# Altium schematic sheet AD5410.SchDoc
size A4
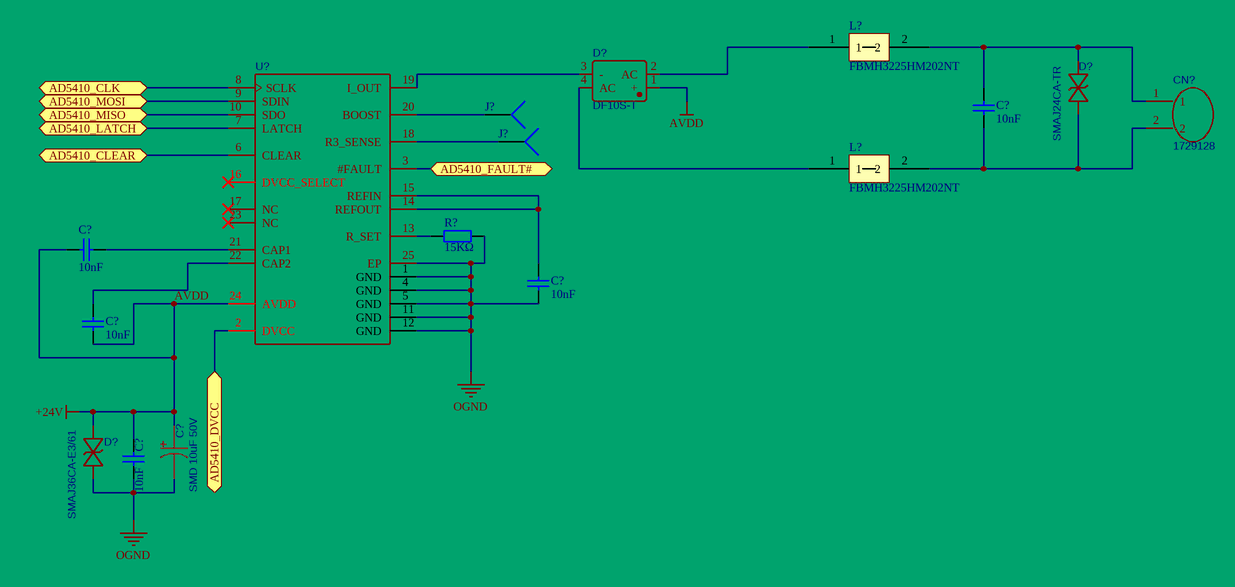
[diagram p0: AD5410.SchDoc]

## Parts
(Parts that share a designator on the sheet are numbered #1, #2 ... from top to bottom, then left to right.)
C?#1  10nF  [0603_C]
C?#2  10nF  [0603_C]
C?#3  10nF  [0603_C]
C?#4  10nF  [0603_C]
C?#5  10nF  [0603_C]
C?#6  SMD 10uF 50V  [CAP-SMD_BD5.0-L5.3-W5.3-FD]
CN?  1729128  [CONN-TH_2P-P5.08_1714984]
D?#1  DF10S-T  [DF-S_L8.4-W6.4-P5.10-LS10.4-TR]
D?#2  SMAJ24CA-TR  [SMA_L4.4-W2.6-LS5.0-BI]
D?#3  SMAJ36CA-E3/61  [SMA_L4.4-W2.6-LS5.0-BI]
J?#1  Socket  [PIN1]  (value not drawn)
J?#2  Socket  [PIN1]  (value not drawn)
L?#1  FBMH3225HM202NT  [1210]
L?#2  FBMH3225HM202NT  [1210]
R?  15KΩ  [0603_R]
U?  AD5410AREZ 4-20mA  [TSSOP-24_L7.8-W4.4-P0.65-LS6.4-TL-EP]  (value not drawn)

## Ports
AD5410_CLEAR, AD5410_CLK, AD5410_DVCC, AD5410_FAULT#, AD5410_LATCH, AD5410_MISO, AD5410_MOSI

## Nets
AVDD: C?#3.2 C?#4.1 C?#5.1 C?#6.1 D?#1.1(+) D?#3.2 U?.24(AVDD)  [also labelled +24V]
OGND: C?#2.2 C?#5.2 C?#6.2 D?#3.1 R?.2 U?.1(GND) U?.4(GND) U?.5(GND) U?.11(GND) U?.12(GND) U?.25(EP)
AD5410_CLEAR: U?.6(CLEAR) ; port AD5410_CLEAR
AD5410_CLK: U?.8(SCLK) ; port AD5410_CLK
AD5410_DVCC: U?.2(DVCC) ; port AD5410_DVCC
AD5410_FAULT#: U?.3(#FAULT) ; port AD5410_FAULT#
AD5410_LATCH: U?.7(LATCH) ; port AD5410_LATCH
AD5410_MISO: U?.10(SDO) ; port AD5410_MISO
AD5410_MOSI: U?.9(SDIN) ; port AD5410_MOSI
NetC?#1_1: C?#1.1 CN?.2 D?#2.1 L?#2.2
NetC?#1_2: C?#1.2 CN?.1 D?#2.2 L?#1.2
NetC?#2_1: C?#2.1 U?.14(REFOUT) U?.15(REFIN)
NetC?#3_1: C?#3.1 U?.21(CAP1)
NetC?#4_2: C?#4.2 U?.22(CAP2)
NetD?#1_2: D?#1.2(AC) L?#1.1
NetD?#1_3: D?#1.3(-) U?.19(I_OUT)
NetD?#1_4: D?#1.4(AC) L?#2.1
NetJ?#1_1: J?#1.1 U?.20(BOOST)
NetJ?#2_1: J?#2.1 U?.18(R3_SENSE)
NetR?_1: R?.1 U?.13(R_SET)

Not connected (* = marked no-connect by the designer): U? 16(DVCC_SELECT)* 17(NC)* 23(NC)*

## Library data of the parts
C?#1-C?#5 = 0603 1nF (102) 10% 50V: 贴片电容; BOM_Manufacturer Part: GRM188R72A103KA01D; BOM_Manufacturer: muRata; Package: 0603
C?#6 = SMD 10uF 50V: BOM_Manufacturer: PANASONIC; BOM_Manufacturer Part: EEE1HA100WAR
CN? = MKDSN1.5/2-5.08: BOM_Manufacturer: Phoenix Contact; BOM_Manufacturer Part: MKDSN1.5/2-5.08
D?#1 = DF10S-T: BOM_Manufacturer: Diodes Incorporated; Contributor: LCSC; SMT Type: Extend; BOM_Supplier: LCSC; BOM_Supplier Part: C102616; BOM_Manufacturer Part: DF10S-T; BOM_JLCPCB SMD: Yes; spicePre: D; spiceSymbolName: DF10S-T
D?#2 = SMAJ36CA-E3/61: BOM_Manufacturer: ST; BOM_Manufacturer Part: SMAJ24CA-TR
D?#3 = SMAJ36CA-E3/61: BOM_Manufacturer: Vishay Intertech; BOM_Manufacturer Part: SMAJ36CA-E3/61
L?#1 L?#2 = 1210 2kΩ@100MHz 1.2A  磁珠: BOM_Manufacturer: Taiyo Yuden; BOM_Manufacturer Part: FBMH3225HM202NT; Package: 1210
R? = 0603 1.1KΩ (1101) 1%: 贴片电阻; BOM_Manufacturer Part: ERA3AED153V; BOM_Manufacturer: PANASONIC; Package: 0603
U? = AD5410AREZ 4-20mA: BOM_Manufacturer: ADI; BOM_Manufacturer Part: AD5410AREZ; Package: TSSOP-24
J?#1 J?#2 = Socket: LatestRevisionDate: 17-Jul-2002; LatestRevisionNote: Re-released for DXP Platform.; Publisher: Altium Limited